# EAGLE design RS41ng_pcb_v1 (EAGLE 9.6.2)
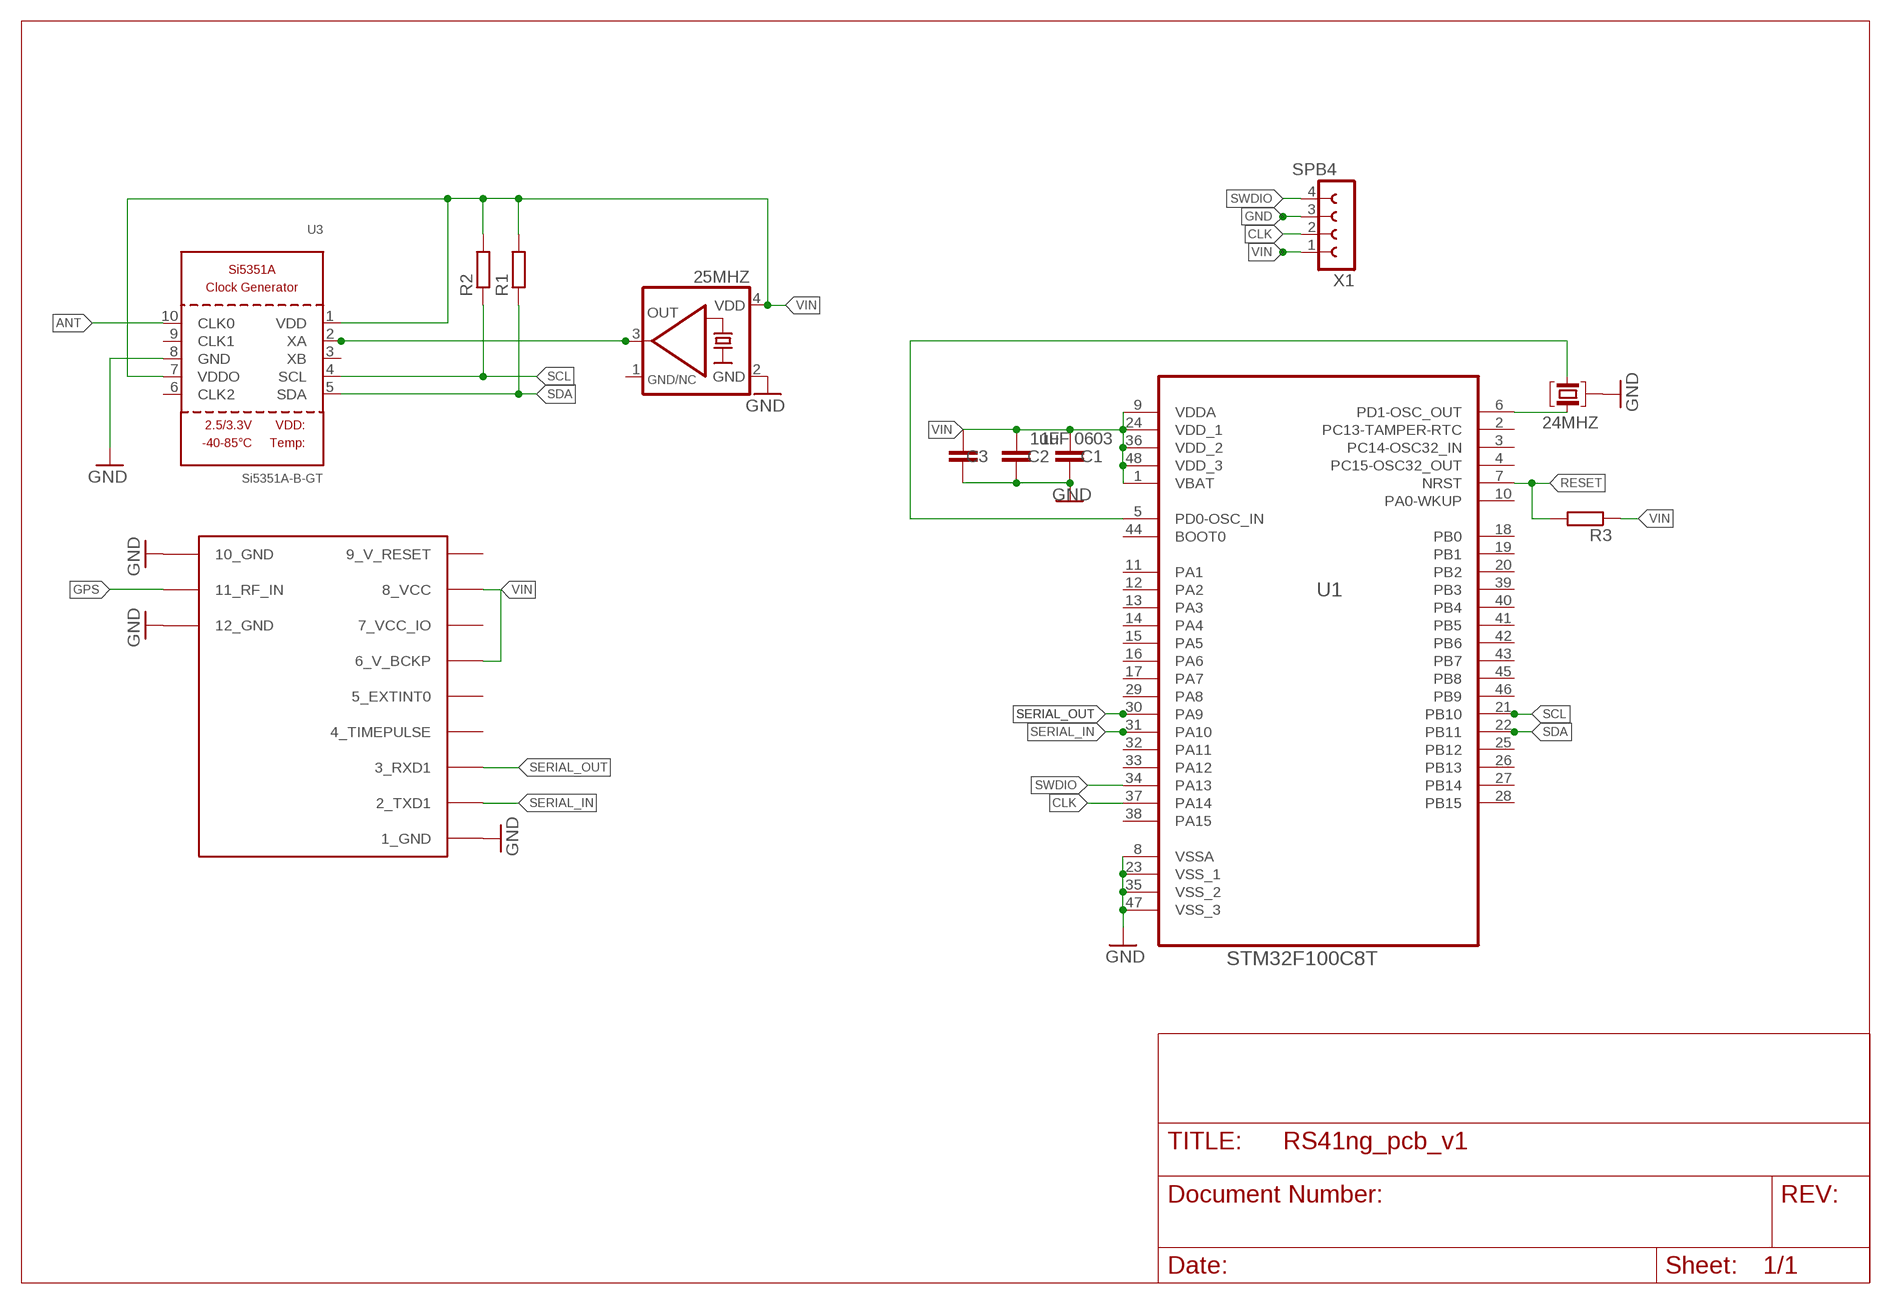
[diagram p0: schematic, sheet 1]

## Parts
24MHZ  24Mhz  ABM8G  [ABM8G]
25MHZ  KXO-TCXO-CMOS-84  [3.2X2.5_KXO-84-TCXO]
C1  1uF 0603  C-EUC0603K  [C0603K]
C2  1uF  C-EUC0603K  [C0603K]
C3  C-EUC1808  [C1808]
R1  R-EU_R0603  [R0603]
R2  R-EU_R0603  [R0603]
R3  R-EU_R0603  [R0603]
U1  STM32F100C8T  STM32F100C8T6B  [QFP50P900X900X160-48N]
U3  Si5351A-B-GT  SI5351A  [MSOP10]
U$2  UBLOX_MAX  [UBLOX_MAX]
X1  SPB4  [SPB4]

## Nets
ANT: U3.10(CLK0)
CLK: U1.37(PA14) X1.2
GND: 24MHZ.2 24MHZ.4 25MHZ.2(GND) C1.2 C2.2 C3.1 U1.8(VSSA) U1.23(VSS_1) U1.35(VSS_2) U1.47(VSS_3) U3.8(GND) U$2.1_GND U$2.10_GND U$2.12_GND X1.3
GPS: U$2.11_RF_IN
N$1: 24MHZ.1 U1.6(PD1-OSC_OUT)
N$2: 24MHZ.3 U1.5(PD0-OSC_IN)
N$19: 25MHZ.3(OUT) U3.2(XA)
RESET: R3.2 U1.7(NRST)
SCL: R2.1 U1.21(PB10) U3.4(SCL)
SDA: R1.1 U1.22(PB11) U3.5(SDA)
SERIAL_IN: U1.31(PA10) U$2.2_TXD1
SERIAL_OUT: U1.30(PA9) U$2.3_RXD1
SWDIO: U1.34(PA13) X1.4
VIN: 25MHZ.4(VDD) C1.1 C2.1 C3.2 R1.2 R2.2 R3.1 U1.1(VBAT) U1.9(VDDA) U1.24(VDD_1) U1.36(VDD_2) U1.48(VDD_3) U3.1(VDD) U3.7(VDDO) U$2.6_V_BCKP U$2.8_VCC X1.1
Unconnected: U1.2(PC13-TAMPER-RTC) U1.3(PC14-OSC32_IN) U1.4(PC15-OSC32_OUT) U1.10(PA0-WKUP) U1.11(PA1) U1.12(PA2) U1.13(PA3) U1.14(PA4) U1.15(PA5) U1.16(PA6) U1.17(PA7) U1.18(PB0) U1.19(PB1) U1.20(PB2) U1.25(PB12) U1.26(PB13) U1.27(PB14) U1.28(PB15) U1.29(PA8) U1.32(PA11) U1.33(PA12) U1.38(PA15) U1.39(PB3) U1.40(PB4) U1.41(PB5) U1.42(PB6) U1.43(PB7) U1.44(BOOT0) U1.45(PB8) U1.46(PB9) U3.3(XB) U3.6(CLK2) U3.9(CLK1) U$2.4_TIMEPULSE U$2.5_EXTINT0

## Power pins joined to a net without a drawn wire
7_VCC_IO: U$2.7_VCC_IO
9_V_RESET: U$2.9_V_RESET
GND/NC: 25MHZ.1(GND/NC)

## Library data of the parts
24MHZ = crystal:ABM8G: CRYSTAL - ABRACON ABM8G Series, 3.2 x 2.5 mm
25MHZ = crystal-geyer_V1_0:KXO-TCXO-CMOS: TCXO : CMOS - Serie Model Size l/w/h [mm] Frequency Range Frequency Stability Temp. Range [°C] Output AECQ 200 availabel Datasheet KXO-86 KXO-84 KXO-83 KXO-82 2.5/2.0/0.7 3.2/2.5/1.0 5.0/3.2/1.5 7.0/5.0/2.4 13,0 ~ 40,0 MHz 10,0 ~ 40,0 MHz 10,0 ~ 40,0 MHz 10,0 ~ 30,0 MHz ±1,0 … ±2,5ppm ±1,0 … ±2,5ppm ±1,0 … ±3,0ppm ±1,0 … ±3,0ppm (*) -30°C …+75°C (*) -40°C …+85°C (*) -40°C …+85°C (*) -30°C …+80°C CMOS CMOS CMOS CMOS - - - - KXO-86.pdf <http://www.geyer-electronic.de/uploads/tx_userartikelfrequenz/GEYER-KXO-86-TCXO-HCMOS.pdf> KXO-84.pdf <http://www.geyer-electronic.de/uploads/tx_userartikelfrequenz/GEYER-KXO-84-TCXO-HCMOS.pdf> KXO-83.pdf <http://www.geyer-electronic.de/uploads/tx_userartikelfrequenz/GEYER-KXO-83-TCXO-HCMOS.pdf> KXO-82.pdf <http://www.geyer-electronic.de/uploads/tx_userartikelfrequenz/GEYER-KXO-82-TCXO-HCMOS.pdf> <http://www.geyer-electronic.de/fileadmin/template/img/logo-geyer-electronic.png> Details see: http://www.geyer-electronic.de/Frequenz-Produkte.9.0.html Created 2016-06-07, Hans Locher 2016 (C) Geyer Quartz Technology KXO86,KXO84,KXO83,KXO82;2550;3225;5032;7050;2,5x2,0;3,2x2,5;2.5x2.0;3.2x2.5,5,0x3,2;7,0x5,0,5.0x3.2,7.0x5.0
C1 C2 = rcl:C-EU: CAPACITOR, European symbol; SPICEPREFIX: C
C3 = resistor:C-EU: CAPACITOR, European symbol
R1-R3 = resistor:R-EU_: RESISTOR, European symbol
U1 = STM32F100C8T6B:STM32F100C8T6B: ARM-based 32-bit MCU Check availability <https://pricing.snapeda.com/parts/STM32F100C8T6B/STMicroelectronics/view-part?ref=eda>; AVAILABILITY: In Stock; DESCRIPTION: ARM® Cortex®-M3 STM32F1 Microcontroller IC 32-Bit 24MHz 64KB (64K x 8) FLASH 48-LQFP (7x7); MF: STMicroelectronics; MP: STM32F100C8T6B; PACKAGE: LQFP-48 STMicroelectronics; PRICE: None; PURCHASE-URL: https://pricing.snapeda.com/search/part/STM32F100C8T6B/?ref=eda
U3 = microbuilder:SI5351A: Si5351A 8kHz-160MHz I2C Clock Generator VDD: 2.5V or 3.3V Input Range: 25MHz or 27MHz XTAL User selectable internal input load capacitors: 6, 8 or 10 pF Output Impedance: 85 Ohm Output Load Capacitance: 5-15pF Operating Temperature: -40°C - 85°C Operating Current (3 outputs): 35mA Output buffer voltage (VDDO): 1.8, 2.5 or 3.3V Note: If VDDO is not used it should be connected to VDD. Unused clock out pins should be left floating.
U$2 = Max gps:UBLOX_MAX: UBLOX MAX
X1 = con-hirschmann:SPB4: CONNECTOR 4 pins; OC_FARNELL: unknown; OC_NEWARK: unknown

## Net classes
0 default: width 0.203 mm
1 vcc: width 0.152 mm, clearance 0.152 mm

## Board
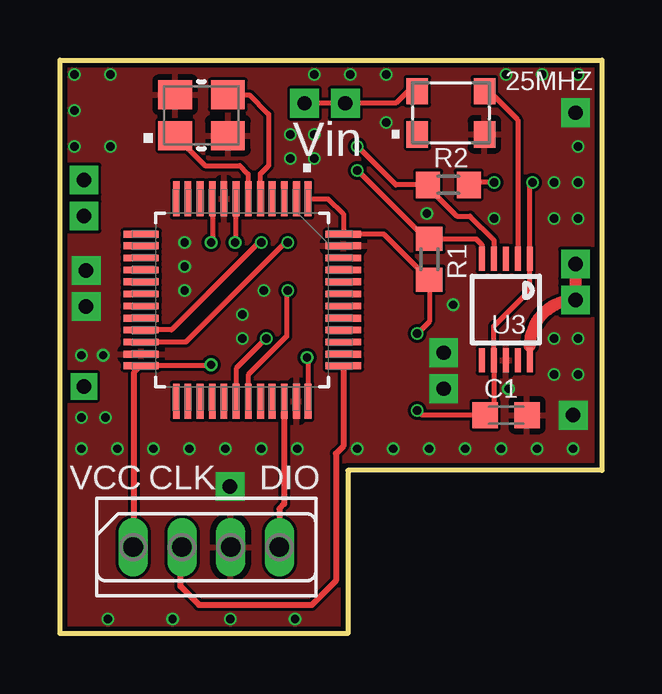
[diagram p1: board, top side]
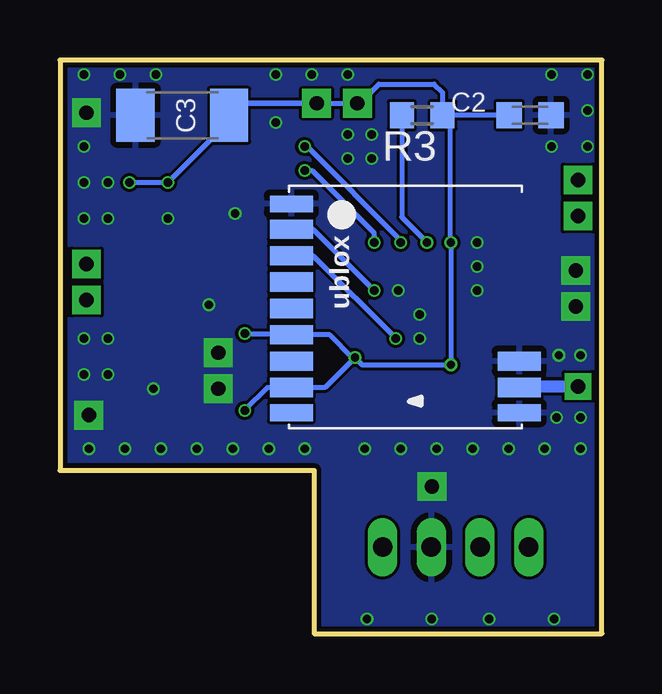
[diagram p2: board, bottom side, seen from below]

Size 22.6 x 23.9 mm. Coordinates in mm from the lower left corner, seen from the top.
Outline: 0,23.9 22.6,23.9 22.6,6.8 12,6.8 12,0 0,0 0,23.9
Copper layers (1*16): Top 0.035559375mm / dielectric 1.6mm / Bottom 0.035559375mm
Design rules "jlcpcb2layer *": minimum track width 5mil, minimum drill 12mil, track to track 5mil, track to pad 5mil, pad to pad 5mil, via to via 5mil, smd to smd 5mil, copper to edge 8mil, drill to drill 6mil, minimum pad ring 5mil, minimum via ring 3mil, stop-mask expansion 2.5mil, vias tented up to drill 14mil, thermal gap 10mil

### Footprints (pad centres in the part's own frame; a part is rotated, then mirrored left to right if it is on the bottom)
ABM8G = smd 1.4 x 1.2: 1 -1.1,-0.85; 2 1.1,-0.85; 3 1.1,0.85; 4 -1.1,0.85
3.2X2.5_KXO-84-TCXO = smd 0.9 x 1.1: 1 -1.4,-0.9; 2 1.4,-0.9; 3 1.4,0.9; 4 -1.4,0.9
C0603K = smd 1.05 x 1.08: 1 -0.875,0; 2 0.875,0
C1808 = smd 1.6 x 2.2: 1 -1.95,0; 2 1.95,0
R0603 = smd 1 x 1.1: 1 -0.85,0; 2 0.85,0
QFP50P900X900X160-48N = smd 1.473 x 0.279: 1 -4.216,2.743; 2 -4.216,2.261; 3 -4.216,1.753; 4 -4.216,1.245; 5 -4.216,0.762; 6 -4.216,0.254; 7 -4.216,-0.254; 8 -4.216,-0.762; 9 -4.216,-1.245; 10 -4.216,-1.753; 11 -4.216,-2.261; 12 -4.216,-2.743; 25 4.216,-2.743; 26 4.216,-2.261; 27 4.216,-1.753; 28 4.216,-1.245; 29 4.216,-0.762; 30 4.216,-0.254; 31 4.216,0.254; 32 4.216,0.762; 33 4.216,1.245; 34 4.216,1.753; 35 4.216,2.261; 36 4.216,2.743 | smd 0.279 x 1.473: 13 -2.743,-4.216; 14 -2.261,-4.216; 15 -1.753,-4.216; 16 -1.245,-4.216; 17 -0.762,-4.216; 18 -0.254,-4.216; 19 0.254,-4.216; 20 0.762,-4.216; 21 1.245,-4.216; 22 1.753,-4.216; 23 2.261,-4.216; 24 2.743,-4.216; 37 2.743,4.216; 38 2.261,4.216; 39 1.753,4.216; 40 1.245,4.216; 41 0.762,4.216; 42 0.254,4.216; 43 -0.254,4.216; 44 -0.762,4.216; 45 -1.245,4.216; 46 -1.753,4.216; 47 -2.261,4.216; 48 -2.743,4.216
MSOP10 = smd 0.25 x 1: 1 -1,-2.113; 2 -0.5,-2.113; 3 0,-2.113; 4 0.5,-2.113; 5 1,-2.113; 6 1,2.113; 7 0.5,2.113; 8 0,2.113; 9 -0.5,2.113; 10 -1,2.113
UBLOX_MAX = smd 1.8 x 0.7: 1_GND 4.95,-4.4; 9_V_RESET 4.95,4.3; 10_GND -4.55,4.3 | smd 1.8 x 0.8: 2_TXD1 4.95,-3.35; 3_RXD1 4.95,-2.25; 4_TIMEPULSE 4.95,-1.15; 5_EXTINT0 4.95,-0.05; 6_V_BCKP 4.95,1.05; 7_VCC_IO 4.95,2.15; 8_VCC 4.95,3.25; 11_RF_IN -4.55,3.25; 12_GND -4.55,2.15
SPB4 = drill 0.813 long: 1 -3.048,0; 2 -1.016,0; 3 1.016,0; 4 3.048,0

### Placement (x,y rotation side)
24MHZ  5.9,21.6 0 top
25MHZ  16.3,21.7 0 top
C1  18.6,9.1 0 top
C2  3,21.6 0 bottom
C3  17.5,21.6 0 bottom
R1  15.4,15.6 270 top
R2  16.2,18.7 0 top
R3  7.5,21.6 180 bottom
U1  7.6,13.9 270 top
U3  18.59,13.5 180 top
U$2  8,13.5 180 bottom
X1  6.1,3.6 0 top

### Tracks (layer width: path | path; a pad name or v marks a point on that pad's centre or on a via)
ANT  (via drill 0.6 pad 1.2)
  Top 0.203: 19.59,11.99 U3.10 | v21.5,13.9 arc90 21.4,13.8
  Top 0.508: v21.5,15.4 v21.5,13.9 arc90 19.59,11.99
CLK
  Top 0.254: U1.37 11.82,7.82 11.5,7.5 11.5,2.2 10.5,1.2 5.8,1.2 5.03,1.97 5.03,3.55 X1.2
GND  (via drill 0.35, 0.6 pad 1.2)
  other vias: 0.9,9 1.09,15.13 1.09,13.63 1.9,9 21.4,9.1 7.09,6.13 7.1,0.6 0.6,23.3 16,10.2 3.9,7.7 5.4,7.7 6.9,7.7 8.4,7.7 9.9,7.7 2.4,7.7 0.9,7.7 12.4,7.7 13.9,7.7 15.4,7.7 16.9,7.7 18.4,7.7 19.9,7.7 21.4,7.7 2,0.6 4.7,0.6 9.8,0.6 0.9,11.6 1.8,11.6 2.1,23.3 12.1,23.3 13.6,23.3 21.6,23.3 21.6,20.3 21.6,18.8 21.6,17.3 20.6,17.3 20.6,18.8 20.6,10.8 20.6,12.3 21.6,12.3 21.6,10.8 10.6,23.3 13.6,21.3 10.6,19.8 10.6,20.8 9.6,20.8 9.6,19.8 16.4,13.7 18.1,17.3 5.2,16.3 5.2,15.3 5.2,14.3 8.5,14.3 7.6,13.3 20.1,23.3 18.6,23.3 7.6,12.3 16,11.7 15.3,17.5 0.6,21.8 0.6,20.3 2.1,20.3 21.5,21.7 18.7,10.2
  pour Top: -4.29,25.42 38.55,25.42 38.55,-3.69 -4.39,-3.69 -4.39,25.32
  pour Bottom: -4.39,25.42 38.55,25.42 38.55,-3.69 -4.39,-3.69
GPS  (via drill 0.6 pad 1.1)
  Bottom 0.508: U$2.11_RF_IN 3.4,10.3 v1,10.3
N$1
  Top 0.203: 24MHZ.1 6.05,19.5 7.5,19.5 7.85,19.15 U1.6
N$2
  Top 0.203: 24MHZ.3 7.9,22.45 8.7,21.65 8.7,19.5 8.36,19.16 U1.5
N$7  (via drill 0.6 pad 1.2)
  other vias: 1,18.9
N$8  (via drill 0.6 pad 1.2)
  other vias: 1,17.4
N$19
  Top 0.203: 25MHZ.3 17.9,22.6 19.09,21.41 U3.2
RESET  (via drill 0.35)
  Top 0.203: U1.7 7.35,16.35 v7.3,16.3
  Bottom 0.203: R3.2 8.35,17.35 v7.3,16.3
SCL  (via drill 0.35)
  Top 0.203: U3.4 18.09,16.41 17.1,17.4 16.55,17.4 15.35,18.6 R2.1 14,18.7 v12.4,20.3 | v8.4,16.3 8.3,16.3 4.65,12.65 U1.21
  Bottom 0.203: v12.4,20.3 12.3,20.3 8.4,16.4 v8.4,16.3
SDA  (via drill 0.35)
  Top 0.203: U1.22 5.25,12.15 9.4,16.3 v9.5,16.3 | v12.4,19.3 15.25,16.45 R1.1 17.35,16.45 17.6,16.2 17.6,15.62 U3.5
  Bottom 0.203: v12.4,19.3 12.1,19.3 9.5,16.7 v9.5,16.3
SERIAL_IN  (via drill 0.35)
  Top 0.203: v9.5,14.3 9.45,14.3 9.45,12.38 7.85,10.78 U1.31
  Bottom 0.203: U$2.2_TXD1 12.05,16.85 v9.5,14.3
SERIAL_OUT  (via drill 0.35)
  Top 0.203: v8.6,12.3 7.35,11.05 U1.30
  Bottom 0.203: U$2.3_RXD1 12.05,15.75 v8.6,12.3
SWDIO
  Top 0.254: X1.4 9.15,5.2 9.35,5.41 U1.34
VIN  (via drill 0.35, 0.6 pad 1.2)
  Top 0.203: v10.2,22.1 v11.9,22.1 14,22.1 14.5,22.6 25MHZ.4 | U1.9 6.36,16.36 v6.3,16.3 | v6.3,11.2 6.26,11.16 U1.24 3.36,11.16 3.1,10.9 | v10.3,11.5 10.34,11.46 U1.36 | v14.9,9.3 15.1,9.1 C1.1 17.73,9.12 18.09,9.49 U3.7 18.09,12.81 19.59,14.31 U3.1 19.59,18.69 v19.7,18.8 | v14.9,12.5 15.4,13 R1.2 13.51,16.64 U1.48 11.82,17.48 11.18,18.12 U1.1 | v18.1,18.8 17.15,18.8 R2.2 | 3.05,3.76 3.1,3.81
  Top 0.254: 3.09,3.8 3.1,3.81 3.1,10.9 | X1.1 3.05,3.76
  Bottom 0.203: v11.9,22.1 v10.2,22.1 10.1,22.1 9.3,22.9 7,22.9 6.65,22.55 R3.1 | R3.1 6.35,21.3 6.35,16.35 v6.3,16.3 v6.3,11.2 10,11.2 v10.3,11.5 | v10.3,11.5 10.4,11.5 11.35,12.45 U$2.6_V_BCKP 13,12.5 v14.9,12.5 | v10.3,11.5 11.55,10.25 U$2.8_VCC 13.95,10.25 v14.9,9.3 | v19.7,18.8 v18.1,18.8 14.8,22.1 v11.9,22.1 | v11.9,22.1 15.05,22.1 C3.2 | C2.1 R3.1

### Text on the board
tNames: . | Vin | . | VCC | CLK | DIO